# EAGLE design HM_Nightfall-mini-2e_Encoder-PCB-R_v1 (EAGLE 9.6.2)
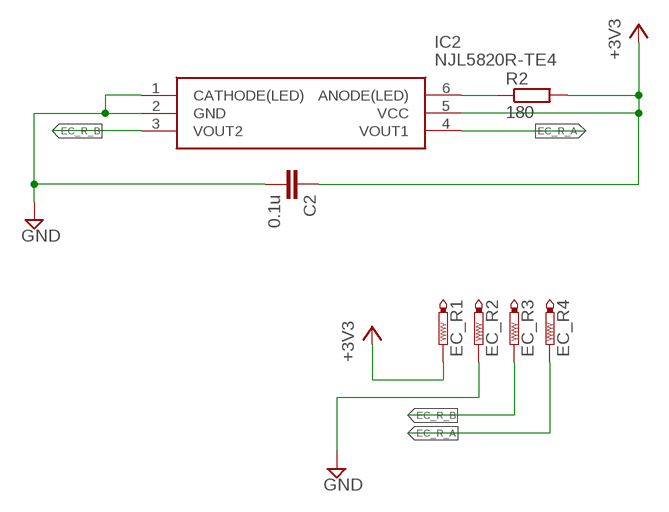
[diagram p0: schematic, sheet 1]

## Parts
C2  0.1u  C-EUC0402  [C0402]
EC_R1  PTR1TP06SQ  [TP06SQ]
EC_R2  PTR1TP06SQ  [TP06SQ]
EC_R3  PTR1TP06SQ  [TP06SQ]
EC_R4  PTR1TP06SQ  [TP06SQ]
IC2  NJL5820R-TE4  [NJL5820RTE4]
R2  180  R-EU_R0402  [R0402]

## Nets
+3V3: C2.1 EC_R1.TP IC2.5(VCC) R2.2
EC_R_A: EC_R4.TP IC2.4(VOUT1)
EC_R_B: EC_R3.TP IC2.3(VOUT2)
GND: C2.2 EC_R2.TP IC2.1(CATHODE(LED)) IC2.2(GND)
N$2: IC2.6(ANODE(LED)) R2.1

## Library data of the parts
C2 = rcl:C-EU: CAPACITOR, European symbol; SPICEPREFIX: C
EC_R1-EC_R4 = testpad:PTR1: TEST PIN
IC2 = NJL5820R-TE4:NJL5820R-TE4: Reflective Optical Sensor Mirror 6-SMD, No Lead Surface Mount 300 A 2.7V ~ 5.5V 6-SMD, No Lead Source: Datasheet <https://www.nisshinbo-microdevices.co.jp/en/pdf/datasheet/NJL5820R_E.pdf>; DESCRIPTION: Reflective Optical Sensor Mirror 6-SMD, No Lead Surface Mount 300 A 2.7V ~ 5.5V 6-SMD, No Lead; HEIGHT: 0.95mm; MANUFACTURER_NAME: Nisshinbo; MANUFACTURER_PART_NUMBER: NJL5820R-TE4; MOUSER_PART_NUMBER: 513-NJL5820R-TE4; MOUSER_PRICE-STOCK: https://www.mouser.co.uk/ProductDetail/Nisshinbo/NJL5820R-TE4?qs=rkhjVJ6%2F3EIV27NvruZpvA%3D%3D
R2 = rcl:R-EU_: RESISTOR, European symbol; SPICEPREFIX: R

## Net classes
1 power: width 0.152 mm
2 motor: width 0.152 mm

## Board
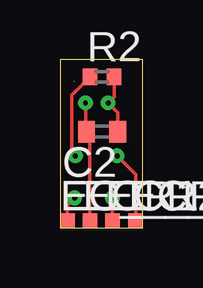
[diagram p1: board, top side]
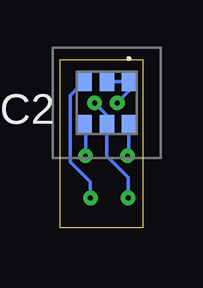
[diagram p2: board, bottom side, seen from below]

Size 3.45 x 7 mm. Coordinates in mm from the lower left corner, seen from the top.
Outline: 0,7 0,0 3.45,0 3.45,7 0,7
Copper layers (1*16): Top 0.035mm / dielectric 1.5mm / Bottom 0.035mm
Design rules "default *": minimum track width 6mil, minimum drill 0.2mm, track to track 4mil, track to pad 4mil, pad to pad 4mil, via to via 4mil, smd to smd 4mil, copper to edge 20mil, drill to drill 6mil, minimum pad ring 10mil, minimum via ring 8mil, stop-mask expansion 4mil, vias tented up to drill 0mil, thermal gap 10mil

### Footprints (pad centres in the part's own frame; a part is rotated, then mirrored left to right if it is on the bottom)
C0402 = smd 0.7 x 0.9: 1 -0.65,0; 2 0.65,0
TP06SQ = smd 0.6 x 0.6: TP 0,0
NJL5820RTE4 = smd 0.6 x 0.8: 1 -0.92,-0.9; 2 0,-0.9; 3 0.92,-0.9; 4 0.92,0.9; 5 0,0.9; 6 -0.92,0.9
R0402 = smd 0.6 x 0.7: 1 -0.5,0; 2 0.5,0

### Placement (x,y rotation side)
C2  1.75,4.01 180 top
EC_R1  0.31,0.3 0 top
EC_R2  1.25,0.3 0 top
EC_R3  2.19,0.3 0 top
EC_R4  3.15,0.3 0 top
IC2  1.5,5.2 180 bottom
R2  1.75,6.29 0 top

### Tracks (layer width: path | path; a pad name or v marks a point on that pad's centre or on a via)
+3V3  (via drill 0.2)
  Top 0.152: R2.2 2.25,5.45 v2.01,5.2 2.4,4.81 C2.1 | EC_R1.TP 0.31,0.93 v0.61,1.24
  Bottom 0.152: v2.01,5.2 1.5,4.69 IC2.5 1.5,2.99 0.61,2.1 v0.61,1.24
EC_R_A  (via drill 0.2)
  Top 0.152: EC_R4.TP 3.15,2.22 v2.38,2.99
  Bottom 0.152: IC2.4 2.38,4.27 v2.38,2.99
EC_R_B  (via drill 0.2)
  Top 0.152: EC_R3.TP v2.19,1.24
  Bottom 0.152: IC2.3 3.02,5.5 3.02,2.73 2.19,1.9 v2.19,1.24
GND  (via drill 0.2)  (1 unrouted)
  Top 0.152: 1.07,4.05 v1.07,5.2 | C2.2 1.25,3.87 EC_R2.TP
  Top 0.2: C2.2 1.07,4.05
  Bottom 0.152: IC2.1 0.58,5.69 v1.07,5.2 | IC2.2 IC2.1
  Bottom 0.2: IC2.1 0.61,6.07
N$2  (via drill 0.2)
  Top 0.152: R2.1 0.48,5.52 0.48,3.15 v0.64,2.99
  Bottom 0.152: IC2.6 0.58,3.05 v0.64,2.99